# Altium schematic sheet PAGE1-CONTENTS.SchDoc
size A3
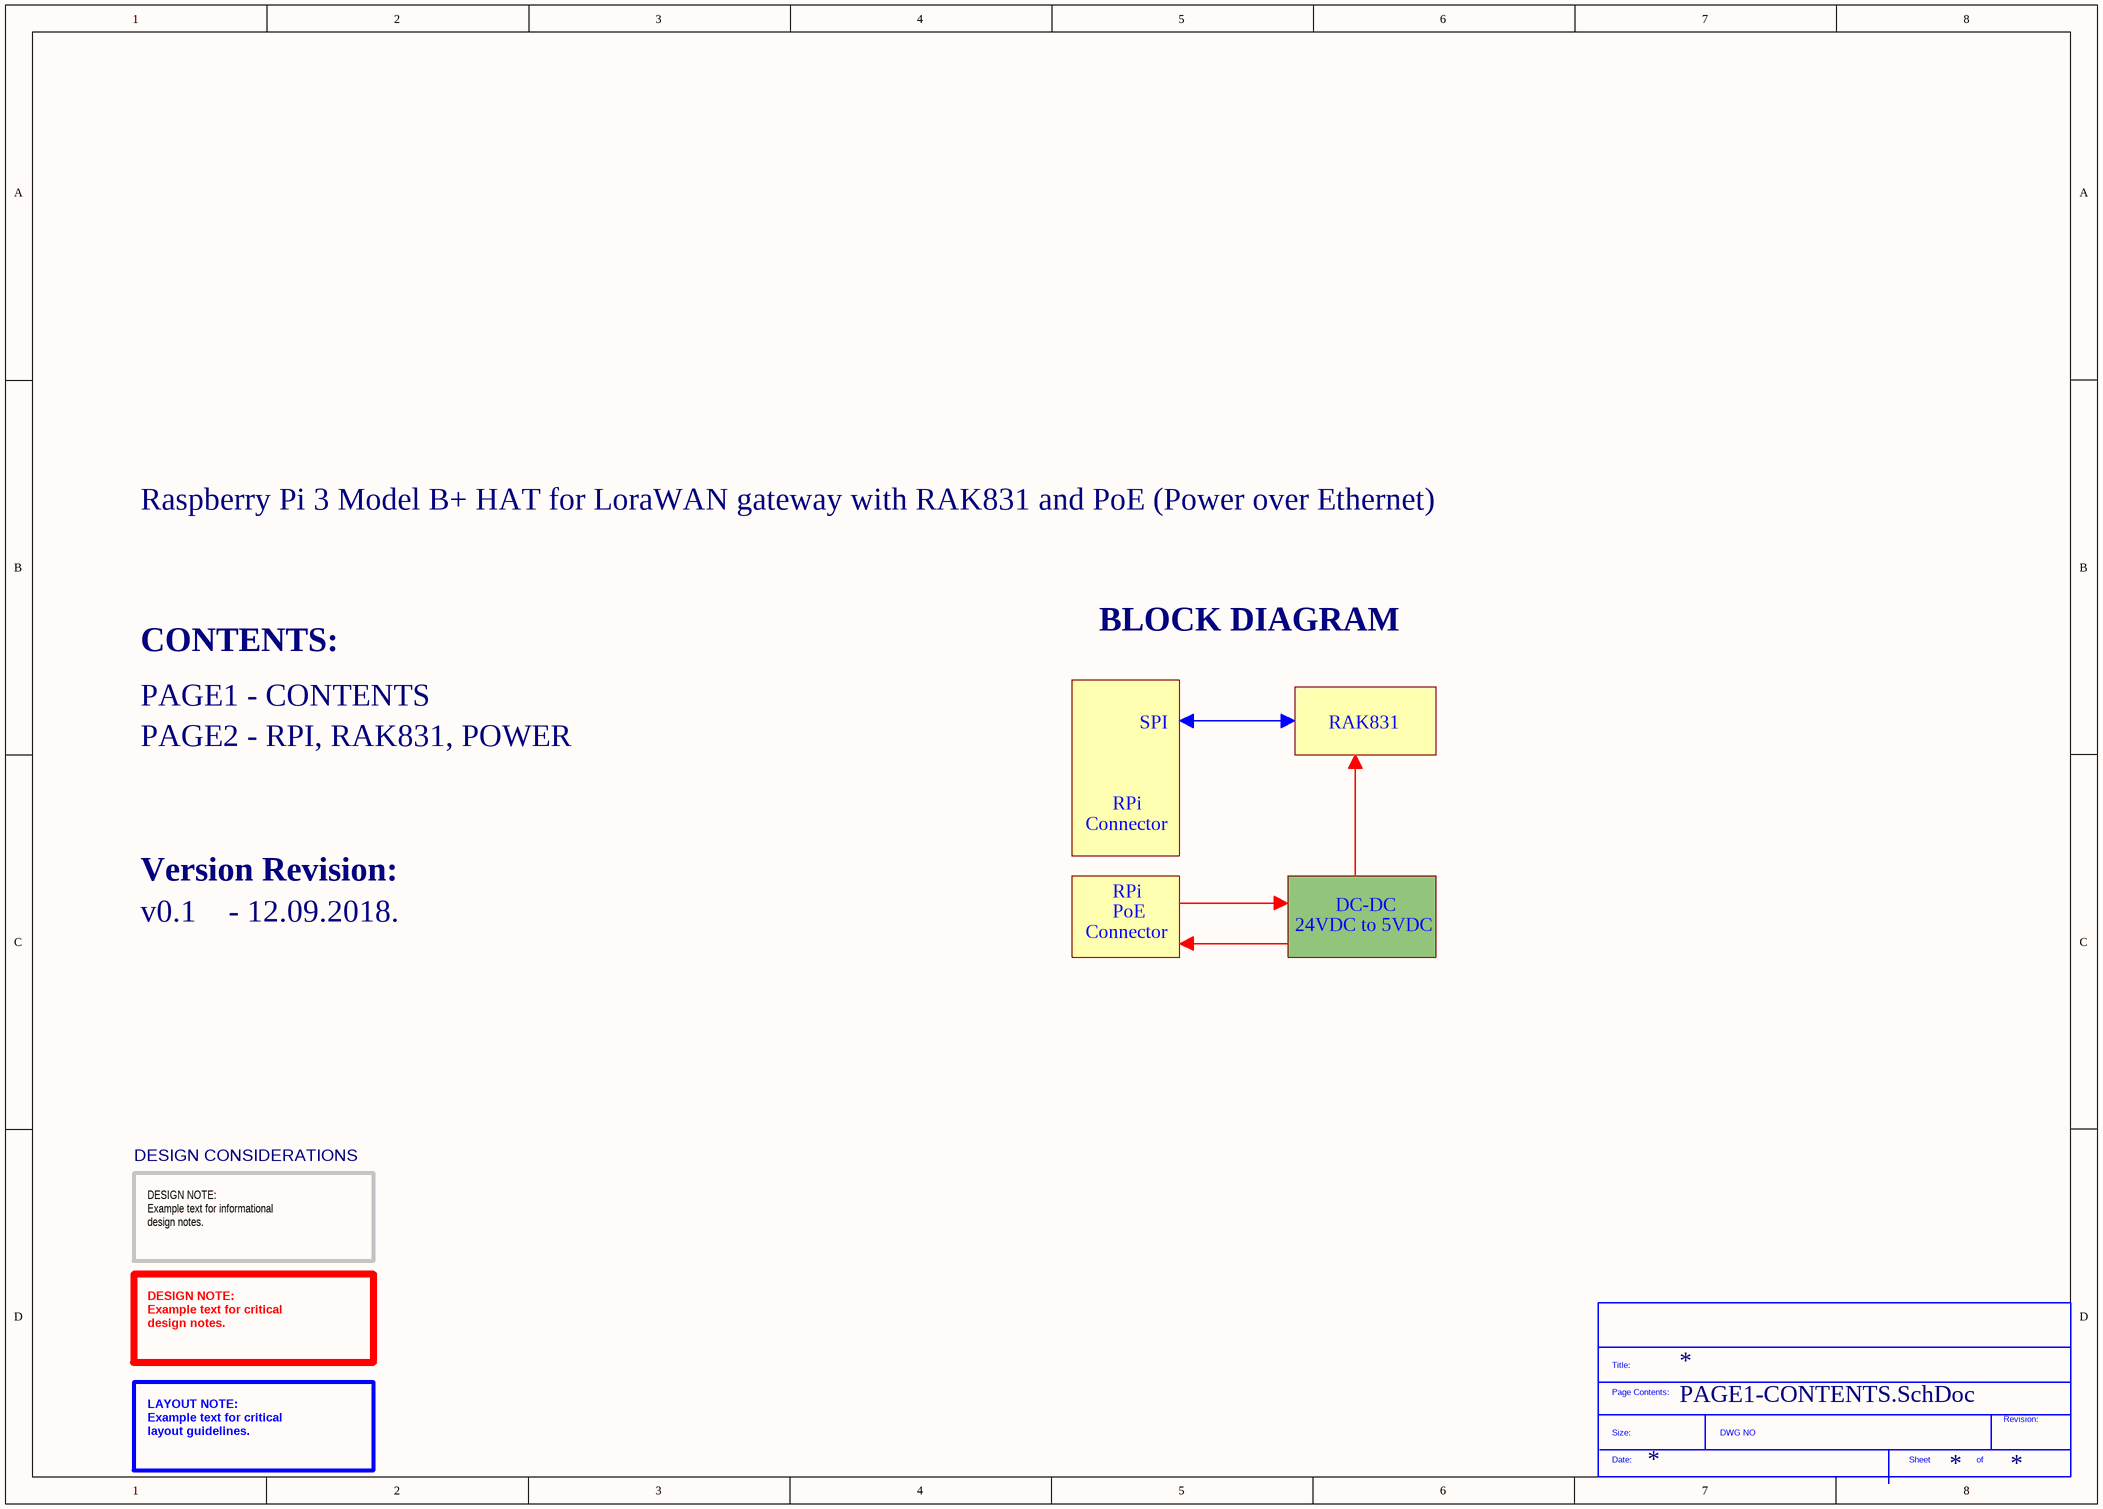
[diagram p0: PAGE1-CONTENTS.SchDoc]

## Parts
*?  SDTitleBlock  (value not drawn)  (graphical)

## Notes on the sheet
- Raspberry Pi 3 Model B+ HAT for LoraWAN gateway with RAK831 and PoE (Power over Ethernet)
- BLOCK DIAGRAM
- CONTENTS:
- PAGE1 - CONTENTS
- PAGE2 - RPI, RAK831, POWER
- SPI
- RAK831
- Connector
- RPi
- Version Revision:
- PoE
- DC-DC
- v0.1    - 12.09.2018.
- 24VDC to 5VDC
- DESIGN CONSIDERATIONS
- DESIGN NOTE:
  Example text for informational
  design notes.
- DESIGN NOTE:
  Example text for critical
  design notes.
- LAYOUT NOTE:
  Example text for critical
  layout guidelines.
- (in symbol SDTitleBlock) Title:; Page Contents:; Revision:; Size:; DWG NO; Date:; Sheet; of